# EAGLE schematic G-300-1000 (EAGLE 7.2.0)
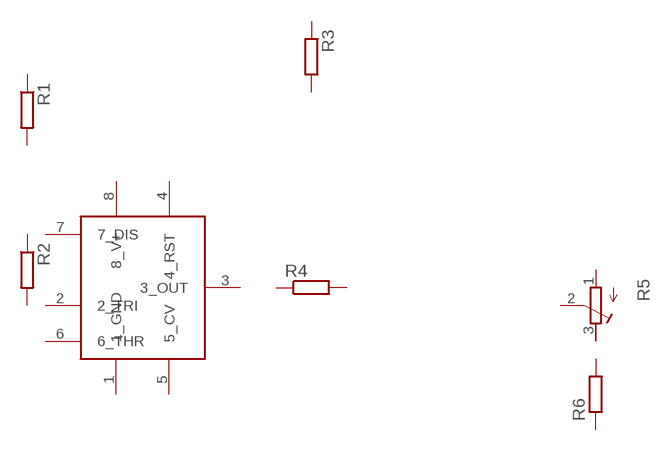
[diagram p0: schematic, sheet 1]

## Parts
R1  R-EU_0204/7  [0204/7]
R2  R-EU_0204/7  [0204/7]
R3  R-EU_0204/7  [0204/7]
R4  R-EU_0204/7  [0204/7]
R5  R-TRIMM3339P  [RTRIM3339P]
R6  R-EU_0207/7  [0207/7]
U$1  NE555  [NE555]
Unconnected: R1.1 R1.2 R2.1 R2.2 R3.1 R3.2 R4.1 R4.2 R5.1(A) R5.2(S) R5.3(E) R6.1 R6.2 U$1.1(1_GND) U$1.2(2_TRI) U$1.3(3_OUT) U$1.4(4_RST) U$1.5(5_CV) U$1.6(6_THR) U$1.7(7_DIS) U$1.8(8_V+)

## Library data of the parts
R1-R4 R6 = rcl:R-EU_: RESISTOR, European symbol
R5 = rcl:R-TRIMM: Trimm resistor
U$1 = Erik:NE555